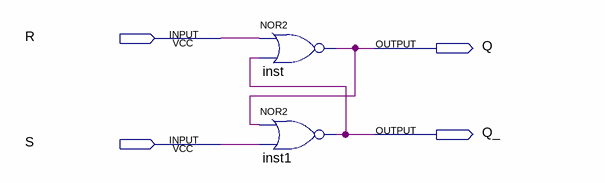
[diagram p0: schematic sheet]
// Quartus schematic SR_LATCH.bdf as structural Verilog: 2 symbols, 4 pins
module SR_LATCH (
  input  R,
  input  S,
  output Q,
  output Q_
);

  nor inst (Q, R, Q_);
  nor inst1 (Q_, Q, S);
endmodule
